# Altium schematic sheet USB.SchDoc
size A4; Author: ALTIUM GOSTBOM2.0 KEV; SheetNumber: 4; SheetTotal: 7
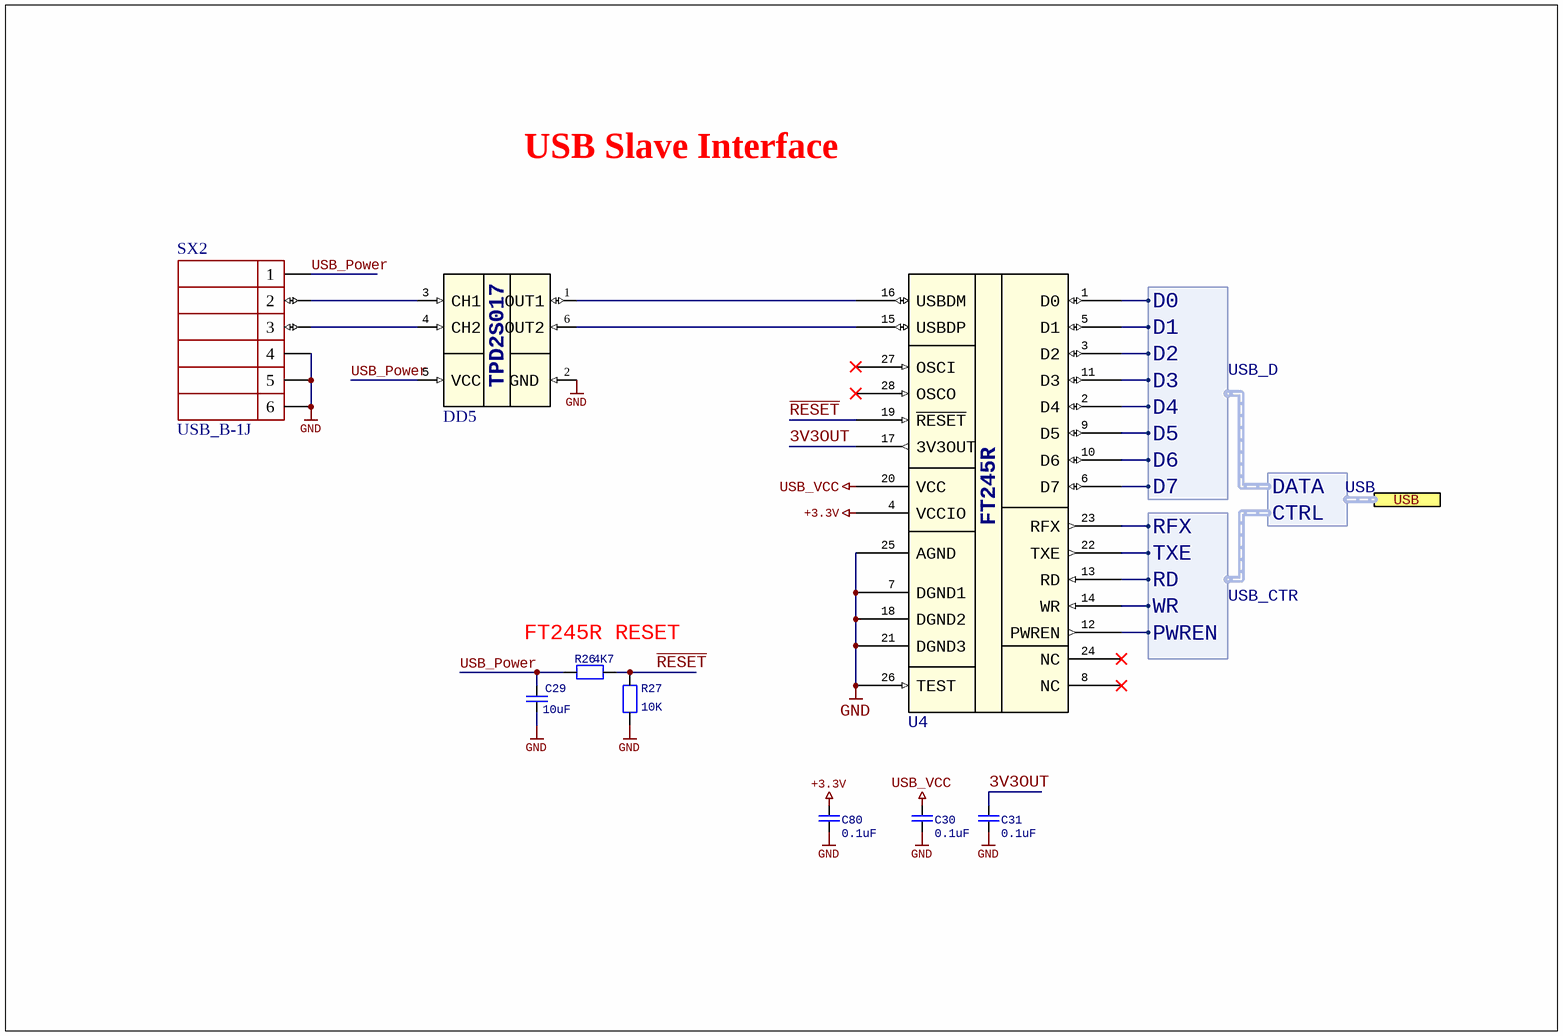
[diagram p0: USB.SchDoc]

## Parts
C29  10uF  [C_0603]
C30  0.1uF  [C_0603]
C31  0.1uF  [C_0603]
C80  0.1uF  [C_0603]
DD5  TPD2S017  [SOT-23-6]  (value not drawn)
R26  4K7  [R_0603]
R27  10K  [R_0603]
SX2  USB_B-1J  [USB_B_(DS1099)]
U4  FT245R  [SSOP- 28]  (value not drawn)

## Ports
USB (harness USB)

## Harnesses
USB_D: D0, D1, D2, D3, D4, D5, D6, D7
USB_CTR: RFX, TXE, RD, WR, PWREN
USB: DATA, CTRL

## Nets
+3.3V: C80.1 U4.4(VCCIO)
GND: C29.1 C30.2 C31.2 C80.2 DD5.2(GND) R27.2 SX2.4 SX2.5 SX2.6 U4.7(DGND1) U4.18(DGND2) U4.21(DGND3) U4.25(AGND) U4.26(TEST)
USB_VCC: C30.1 U4.20(VCC)
3V3OUT: C31.1 U4.17(3V3OUT)
~{RESET}: R26.2 R27.1 U4.19(~{RESET})
USB_Power: C29.2 DD5.5(VCC) R26.1 SX2.1
NetDD5_1: DD5.1(OUT1) U4.16(USBDM)
NetDD5_3: DD5.3(CH1) SX2.2
NetDD5_4: DD5.4(CH2) SX2.3
NetDD5_6: DD5.6(OUT2) U4.15(USBDP)
NetU4_1: U4.1(D0) ; harness USB_D.D0
NetU4_2: U4.2(D4) ; harness USB_D.D4
NetU4_3: U4.3(D2) ; harness USB_D.D2
NetU4_5: U4.5(D1) ; harness USB_D.D1
NetU4_6: U4.6(D7) ; harness USB_D.D7
NetU4_9: U4.9(D5) ; harness USB_D.D5
NetU4_10: U4.10(D6) ; harness USB_D.D6
NetU4_11: U4.11(D3) ; harness USB_D.D3
NetU4_12: U4.12(PWREN) ; harness USB_CTR.PWREN
NetU4_13: U4.13(RD) ; harness USB_CTR.RD
NetU4_14: U4.14(WR) ; harness USB_CTR.WR
NetU4_22: U4.22(TXE) ; harness USB_CTR.TXE
NetU4_23: U4.23(RFX) ; harness USB_CTR.RFX

Not connected (* = marked no-connect by the designer): U4 8(NC)* 24(NC)* 27(OSCI)* 28(OSCO)*

## Notes on the sheet
- USB Slave Interface
- FT245R RESET
- Перв. примен.
- Справ. №
- Подп. дата
- Инв. № дубл.
- Взам. инв. №
- Подп. и дата
- Изм.
- Разраб.
- Лист
- № докум.
- Подп.
- Дата
- Лит.
- Масса
- Масштаб
- Пров.
- Т.контр.
- Листов
- Инв. № подл.
- Н.контр.
- Утв.
- ALTIUM GOSTBOM2.0 KEV
- Файл:
- Копировал
- Формат А3

## Library data of the parts
C29-C31 C80 = C: Non-polarised capacitor; ComponentLink1Description: Manufacturer Link; ComponentLink1URL: www.murata.com; ComponentLink2Description: Datasheet Link; ComponentLink2URL: http://www.murata.com/products/catalog/pdf/c02e.pdf; ValueSCH: *
R26 R27 = R
SX2 = USBA-1J